# Altium schematic sheet 12V_5V_LDO.SchDoc
size A
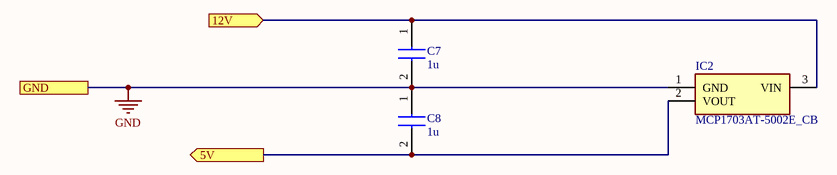
[diagram p0: 12V_5V_LDO.SchDoc]

## Parts
C7  1u  [CAPC2012X145N]
C8  1u  [CAPC2012X145N]
IC2  MCP1703AT-5002E_CB  [SOT95P255X145-3N]

## Ports
5V (out), 12V (in), GND

## Nets
GND: C7.2 C8.1 IC2.1(GND) ; port GND
5V: C8.2 IC2.2(VOUT) ; port 5V
12V: C7.1 IC2.3(VIN) ; port 12V

## Library data of the parts
C7 C8 = KGM21AV51H105ZU: Capacitor; Manufacturer_Name: Kyocera AVX; Datasheet Link: https://www.mouser.com/datasheet/2/40/KGM_Y5V-3223189.pdf; Height: 1.45mm; Manufacturer_Part_Number: KGM21AV51H105ZU
IC2 = MCP1703AT-5002E_CB: Integrated Circuit; Manufacturer_Name: Microchip; Manufacturer_Part_Number: MCP1703AT-5002E/CB; Datasheet Link: http://uk.rs-online.com/web/p/products/7709511; Height: 1.45mm; Mouser Part Number: 579-MCP1703AT5002ECB; Mouser Price/Stock: https://www.mouser.co.uk/ProductDetail/Microchip-Technology/MCP1703AT-5002E-CB?qs=PZkJWYMe7lfGlNu7PCEqfg%3D%3D; Arrow Part Number: MCP1703AT-5002E/CB; Arrow Price/Stock: https://www.arrow.com/en/products/mcp1703at-5002ecb/microchip-technology?utm_currency=USD&region=nac